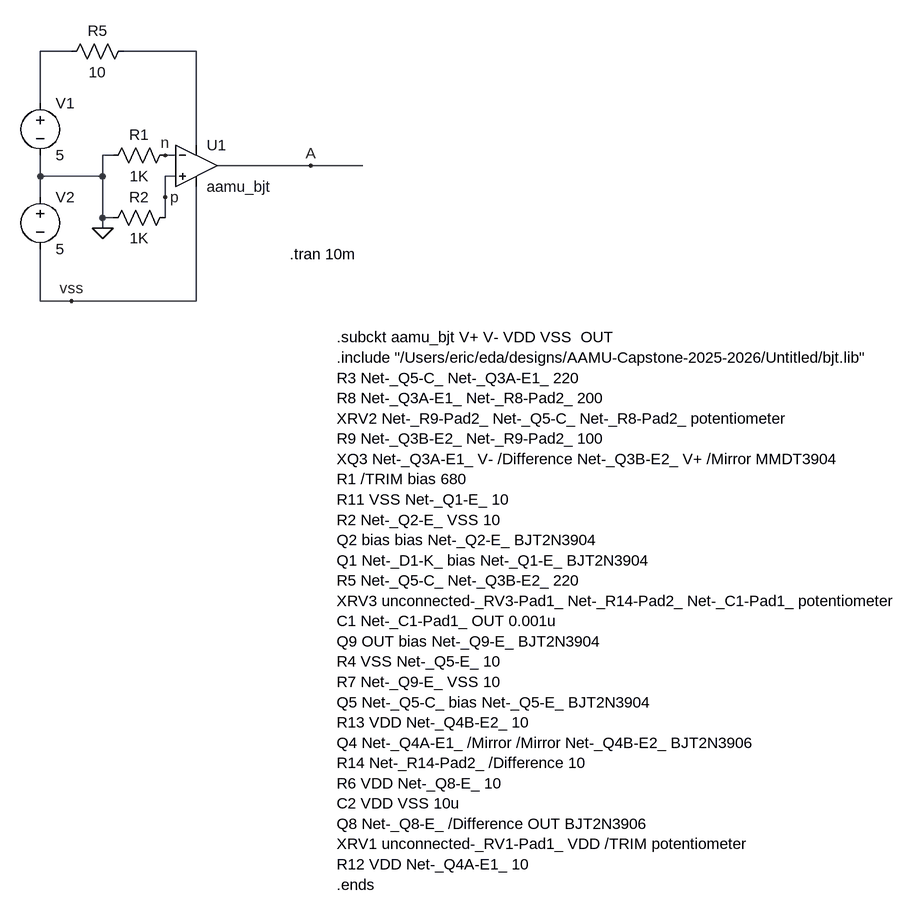
[diagram p0: schematic Draft1.asc]
Draft1.asc, the LTspice schematic file:
Version 4
SHEET 1 1340 836
WIRE 64 -256 16 -256
WIRE 256 -256 144 -256
WIRE 16 -176 16 -256
WIRE 256 -112 256 -256
WIRE 128 -96 112 -96
WIRE 224 -96 208 -96
WIRE 432 -80 288 -80
WIRE 512 -80 432 -80
WIRE 16 -64 16 -96
WIRE 112 -64 112 -96
WIRE 112 -64 16 -64
WIRE 224 -64 208 -64
WIRE 16 -32 16 -64
WIRE 208 -32 208 -64
WIRE 112 0 112 -64
WIRE 128 0 112 0
WIRE 208 0 208 -32
WIRE 112 16 112 0
WIRE 16 128 16 48
WIRE 64 128 16 128
WIRE 256 128 256 -48
WIRE 256 128 64 128
FLAG 432 -80 A
FLAG 64 128 vss
FLAG 112 16 0
FLAG 208 -32 p
FLAG 208 -96 n
DATAFLAG 160 128 "$"
DATAFLAG 496 -80 "$"
DATAFLAG 208 -256 "$"
DATAFLAG 32 -256 "$"
SYMBOL OpAmps/opamp2 256 -144 R0
SYMATTR InstName U1
SYMATTR Value aamu_bjt
SYMBOL voltage 16 -192 R0
SYMATTR InstName V1
SYMATTR Value 5
SYMBOL voltage 16 -48 R0
SYMATTR InstName V2
SYMATTR Value 5
SYMBOL Res 224 -112 R90
WINDOW 0 0 56 VBottom 2
WINDOW 3 32 56 VTop 2
SYMATTR InstName R1
SYMATTR Value 1K
SYMBOL Res 224 -16 R90
WINDOW 0 0 56 VBottom 2
WINDOW 3 32 56 VTop 2
SYMATTR InstName R2
SYMATTR Value 1K
SYMBOL Res 160 -272 R90
WINDOW 0 0 56 VBottom 2
WINDOW 3 32 56 VTop 2
SYMATTR InstName R5
SYMATTR Value 10
TEXT 472 184 Left 2 !.subckt aamu_bjt V+ V- VDD VSS  OUT \n.include "/Users/eric/eda/designs/AAMU-Capstone-2025-2026/Untitled/bjt.lib"\nR3 Net-_Q5-C_ Net-_Q3A-E1_ 220\nR8 Net-_Q3A-E1_ Net-_R8-Pad2_ 200\nXRV2 Net-_R9-Pad2_ Net-_Q5-C_ Net-_R8-Pad2_ potentiometer\nR9 Net-_Q3B-E2_ Net-_R9-Pad2_ 100\nXQ3 Net-_Q3A-E1_ V- /Difference Net-_Q3B-E2_ V+ /Mirror MMDT3904\nR1 /TRIM bias 680\nR11 VSS Net-_Q1-E_ 10\nR2 Net-_Q2-E_ VSS 10\nQ2 bias bias Net-_Q2-E_ BJT2N3904\nQ1 Net-_D1-K_ bias Net-_Q1-E_ BJT2N3904\nR5 Net-_Q5-C_ Net-_Q3B-E2_ 220\nXRV3 unconnected-_RV3-Pad1_ Net-_R14-Pad2_ Net-_C1-Pad1_ potentiometer\nC1 Net-_C1-Pad1_ OUT 0.001u\nQ9 OUT bias Net-_Q9-E_ BJT2N3904\nR4 VSS Net-_Q5-E_ 10\nR7 Net-_Q9-E_ VSS 10\nQ5 Net-_Q5-C_ bias Net-_Q5-E_ BJT2N3904\nR13 VDD Net-_Q4B-E2_ 10\nQ4 Net-_Q4A-E1_ /Mirror /Mirror Net-_Q4B-E2_ BJT2N3906\nR14 Net-_R14-Pad2_ /Difference 10\nR6 VDD Net-_Q8-E_ 10\nC2 VDD VSS 10u\nQ8 Net-_Q8-E_ /Difference OUT BJT2N3906\nXRV1 unconnected-_RV1-Pad1_ VDD /TRIM potentiometer\nR12 VDD Net-_Q4A-E1_ 10\n.ends
TEXT 400 56 Left 2 !.tran 10m

The netlist it stands for:
* Draft1.asc
XU1 p n N002 vss A aamu_bjt  ; pins In+ In- V+ V- OUT
V1 N001 0 5
V2 0 vss 5
R1 n 0 1K
R2 p 0 1K
R5 N002 N001 10
.subckt aamu_bjt V+ V- VDD VSS  OUT
.include "/Users/eric/eda/designs/AAMU-Capstone-2025-2026/Untitled/bjt.lib"
R3 Net-_Q5-C_ Net-_Q3A-E1_ 220
R8 Net-_Q3A-E1_ Net-_R8-Pad2_ 200
XRV2 Net-_R9-Pad2_ Net-_Q5-C_ Net-_R8-Pad2_ potentiometer
R9 Net-_Q3B-E2_ Net-_R9-Pad2_ 100
XQ3 Net-_Q3A-E1_ V- /Difference Net-_Q3B-E2_ V+ /Mirror MMDT3904
R1 /TRIM bias 680
R11 VSS Net-_Q1-E_ 10
R2 Net-_Q2-E_ VSS 10
Q2 bias bias Net-_Q2-E_ BJT2N3904
Q1 Net-_D1-K_ bias Net-_Q1-E_ BJT2N3904
R5 Net-_Q5-C_ Net-_Q3B-E2_ 220
XRV3 unconnected-_RV3-Pad1_ Net-_R14-Pad2_ Net-_C1-Pad1_ potentiometer
C1 Net-_C1-Pad1_ OUT 0.001u
Q9 OUT bias Net-_Q9-E_ BJT2N3904
R4 VSS Net-_Q5-E_ 10
R7 Net-_Q9-E_ VSS 10
Q5 Net-_Q5-C_ bias Net-_Q5-E_ BJT2N3904
R13 VDD Net-_Q4B-E2_ 10
Q4 Net-_Q4A-E1_ /Mirror /Mirror Net-_Q4B-E2_ BJT2N3906
R14 Net-_R14-Pad2_ /Difference 10
R6 VDD Net-_Q8-E_ 10
C2 VDD VSS 10u
Q8 Net-_Q8-E_ /Difference OUT BJT2N3906
XRV1 unconnected-_RV1-Pad1_ VDD /TRIM potentiometer
R12 VDD Net-_Q4A-E1_ 10
.ends
.tran 10m
.backanno
.end